# Altium schematic sheet InSwitchLEDs.SchDoc
size A4; SheetNumber: 2; SheetTotal: 2
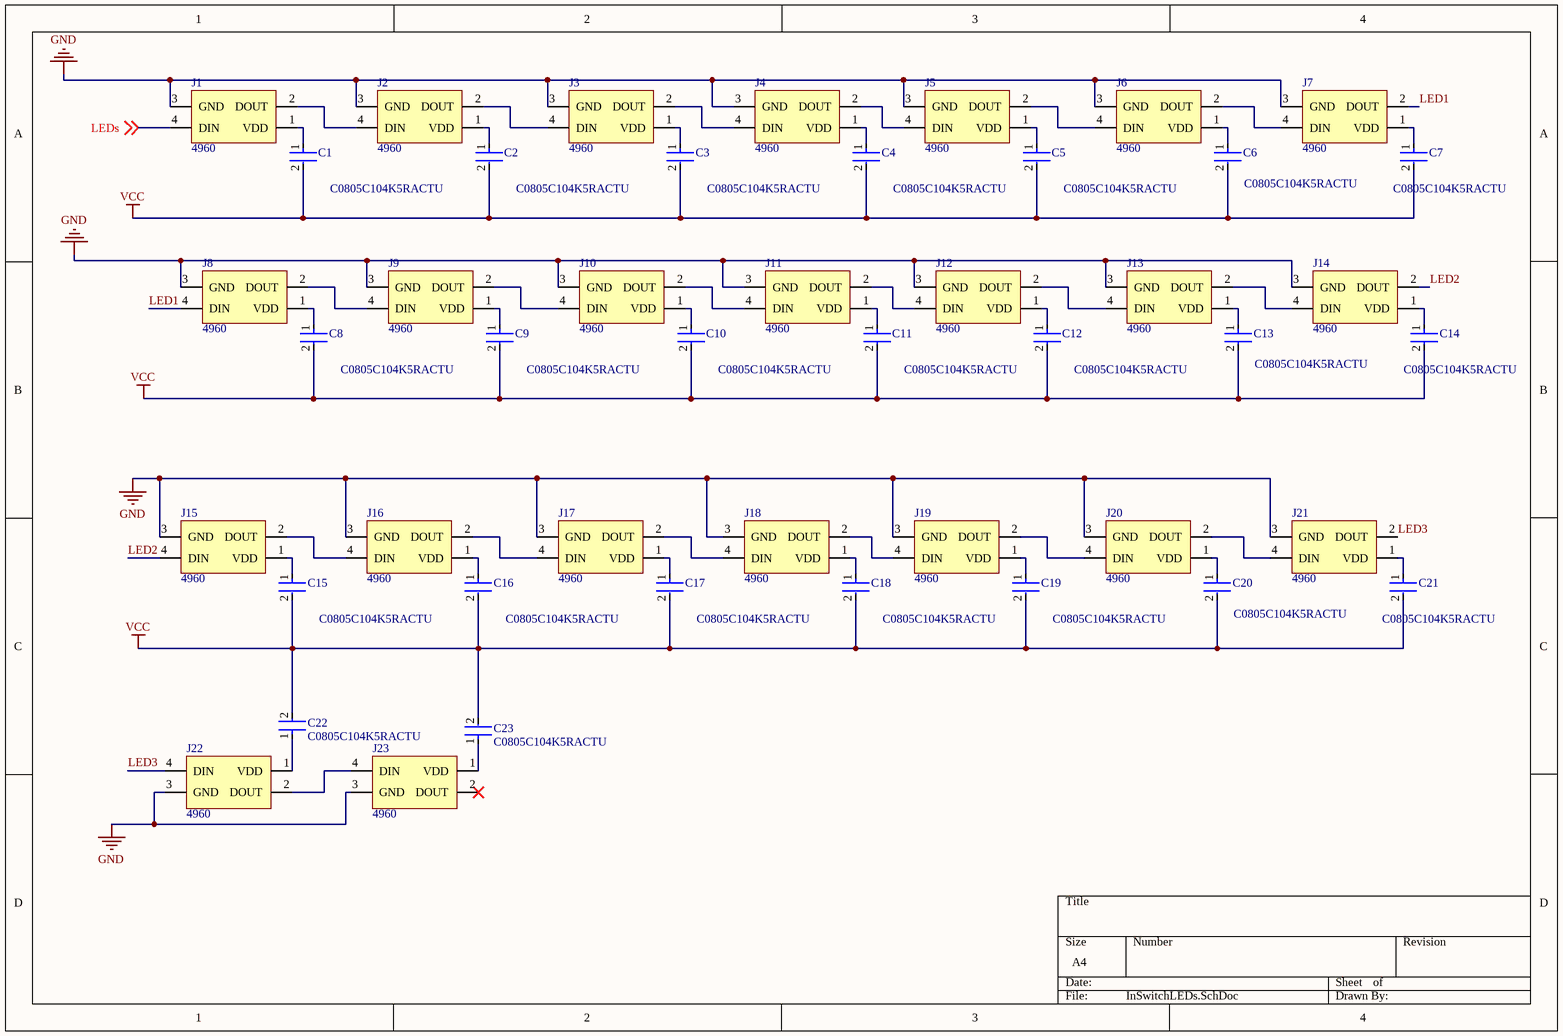
[diagram p0: InSwitchLEDs.SchDoc]

## Parts
C1  C0805C104K5RACTU  [FP-C0805C-DN-MFG]
C2  C0805C104K5RACTU  [FP-C0805C-DN-MFG]
C3  C0805C104K5RACTU  [FP-C0805C-DN-MFG]
C4  C0805C104K5RACTU  [FP-C0805C-DN-MFG]
C5  C0805C104K5RACTU  [FP-C0805C-DN-MFG]
C6  C0805C104K5RACTU  [FP-C0805C-DN-MFG]
C7  C0805C104K5RACTU  [FP-C0805C-DN-MFG]
C8  C0805C104K5RACTU  [FP-C0805C-DN-MFG]
C9  C0805C104K5RACTU  [FP-C0805C-DN-MFG]
C10  C0805C104K5RACTU  [FP-C0805C-DN-MFG]
C11  C0805C104K5RACTU  [FP-C0805C-DN-MFG]
C12  C0805C104K5RACTU  [FP-C0805C-DN-MFG]
C13  C0805C104K5RACTU  [FP-C0805C-DN-MFG]
C14  C0805C104K5RACTU  [FP-C0805C-DN-MFG]
C15  C0805C104K5RACTU  [FP-C0805C-DN-MFG]
C16  C0805C104K5RACTU  [FP-C0805C-DN-MFG]
C17  C0805C104K5RACTU  [FP-C0805C-DN-MFG]
C18  C0805C104K5RACTU  [FP-C0805C-DN-MFG]
C19  C0805C104K5RACTU  [FP-C0805C-DN-MFG]
C20  C0805C104K5RACTU  [FP-C0805C-DN-MFG]
C21  C0805C104K5RACTU  [FP-C0805C-DN-MFG]
C22  C0805C104K5RACTU  [FP-C0805C-DN-MFG]
C23  C0805C104K5RACTU  [FP-C0805C-DN-MFG]
J1  4960  [4960_Adafruit]
J2  4960  [4960_Adafruit]
J3  4960  [4960_Adafruit]
J4  4960  [4960_Adafruit]
J5  4960  [4960_Adafruit]
J6  4960  [4960_Adafruit]
J7  4960  [4960_Adafruit]
J8  4960  [4960_Adafruit]
J9  4960  [4960_Adafruit]
J10  4960  [4960_Adafruit]
J11  4960  [4960_Adafruit]
J12  4960  [4960_Adafruit]
J13  4960  [4960_Adafruit]
J14  4960  [4960_Adafruit]
J15  4960  [4960_Adafruit]
J16  4960  [4960_Adafruit]
J17  4960  [4960_Adafruit]
J18  4960  [4960_Adafruit]
J19  4960  [4960_Adafruit]
J20  4960  [4960_Adafruit]
J21  4960  [4960_Adafruit]
J22  4960  [4960_Adafruit]
J23  4960  [4960_Adafruit]

## Nets
GND: J1.3(GND) J2.3(GND) J3.3(GND) J4.3(GND) J5.3(GND) J6.3(GND) J7.3(GND) J8.3(GND) J9.3(GND) J10.3(GND) J11.3(GND) J12.3(GND) J13.3(GND) J14.3(GND) J15.3(GND) J16.3(GND) J17.3(GND) J18.3(GND) J19.3(GND) J20.3(GND) J21.3(GND) J22.3(GND) J23.3(GND)
VCC: C1.2 C2.2 C3.2 C4.2 C5.2 C6.2 C7.2 C8.2 C9.2 C10.2 C11.2 C12.2 C13.2 C14.2 C15.2 C16.2 C17.2 C18.2 C19.2 C20.2 C21.2 C22.2 C23.2
LED1: J7.2(DOUT) J8.4(DIN)
LED2: J14.2(DOUT) J15.4(DIN)
LED3: J21.2(DOUT) J22.4(DIN)
LEDs: J1.4(DIN) ; off-sheet LEDs
NetC1_1: C1.1 J1.1(VDD)
NetC2_1: C2.1 J2.1(VDD)
NetC3_1: C3.1 J3.1(VDD)
NetC4_1: C4.1 J4.1(VDD)
NetC5_1: C5.1 J5.1(VDD)
NetC6_1: C6.1 J6.1(VDD)
NetC7_1: C7.1 J7.1(VDD)
NetC8_1: C8.1 J8.1(VDD)
NetC9_1: C9.1 J9.1(VDD)
NetC10_1: C10.1 J10.1(VDD)
NetC11_1: C11.1 J11.1(VDD)
NetC12_1: C12.1 J12.1(VDD)
NetC13_1: C13.1 J13.1(VDD)
NetC14_1: C14.1 J14.1(VDD)
NetC15_1: C15.1 J15.1(VDD)
NetC16_1: C16.1 J16.1(VDD)
NetC17_1: C17.1 J17.1(VDD)
NetC18_1: C18.1 J18.1(VDD)
NetC19_1: C19.1 J19.1(VDD)
NetC20_1: C20.1 J20.1(VDD)
NetC21_1: C21.1 J21.1(VDD)
NetC22_1: C22.1 J22.1(VDD)
NetC23_1: C23.1 J23.1(VDD)
NetJ1_2: J1.2(DOUT) J2.4(DIN)
NetJ2_2: J2.2(DOUT) J3.4(DIN)
NetJ3_2: J3.2(DOUT) J4.4(DIN)
NetJ4_2: J4.2(DOUT) J5.4(DIN)
NetJ5_2: J5.2(DOUT) J6.4(DIN)
NetJ6_2: J6.2(DOUT) J7.4(DIN)
NetJ8_2: J8.2(DOUT) J9.4(DIN)
NetJ9_2: J9.2(DOUT) J10.4(DIN)
NetJ10_2: J10.2(DOUT) J11.4(DIN)
NetJ11_2: J11.2(DOUT) J12.4(DIN)
NetJ12_2: J12.2(DOUT) J13.4(DIN)
NetJ13_2: J13.2(DOUT) J14.4(DIN)
NetJ15_2: J15.2(DOUT) J16.4(DIN)
NetJ16_2: J16.2(DOUT) J17.4(DIN)
NetJ17_2: J17.2(DOUT) J18.4(DIN)
NetJ18_2: J18.2(DOUT) J19.4(DIN)
NetJ19_2: J19.2(DOUT) J20.4(DIN)
NetJ20_2: J20.2(DOUT) J21.4(DIN)
NetJ22_2: J22.2(DOUT) J23.4(DIN)

Not connected (* = marked no-connect by the designer): J23 2(DOUT)*

## Library data of the parts
C1-C23 = CMP-2007-00279-2: CAP CER 0.1UF 50V X7R 0805; Manufacturer: KEMET; Value: 0.10 μF; Tolerance: 0.1; Temperature Coefficient: 30ppm/°C; Material: Ceramic; Manufacturer Part Number: C0805C104K5RACTU; Device Class L2: Capacitors; Temperature Range Low: -55°C; Voltage Rating: 50 V; Digikey Description: CAP CER 0.1UF 50V X7R 0805; Category: Cap; ComponentLink2Description: Datasheet; Octopart: https://octopart.com/c0805c104k5ractu-kemet-143926; RoHS: TRUE; ComponentLink2URL: https://content.kemet.com/datasheets/KEM_C1003_C0G_SMD.pdf; Temperature Characteristic: X7R; Temperature: -55°C to +125°C; Height: 0.88mm; Temperature Range High: +125°C; Device Class L1: Passive Components; Automotive: No; Lead Free: Yes; Ipc Land Pattern Name: CAPC200125X78; Device Class L3: Ceramic Capacitors; Mouser Description: Cap Ceramic 0.1uF 50V X7R 10% SMD 2.0 x 1.2 mm 125 C Paper T/R; Capacitance: 0.10 μF; Package: C0805C-DN
J1-J23 = Component_1